# EAGLE design ll4-sensor-comm (EAGLE 5.10)
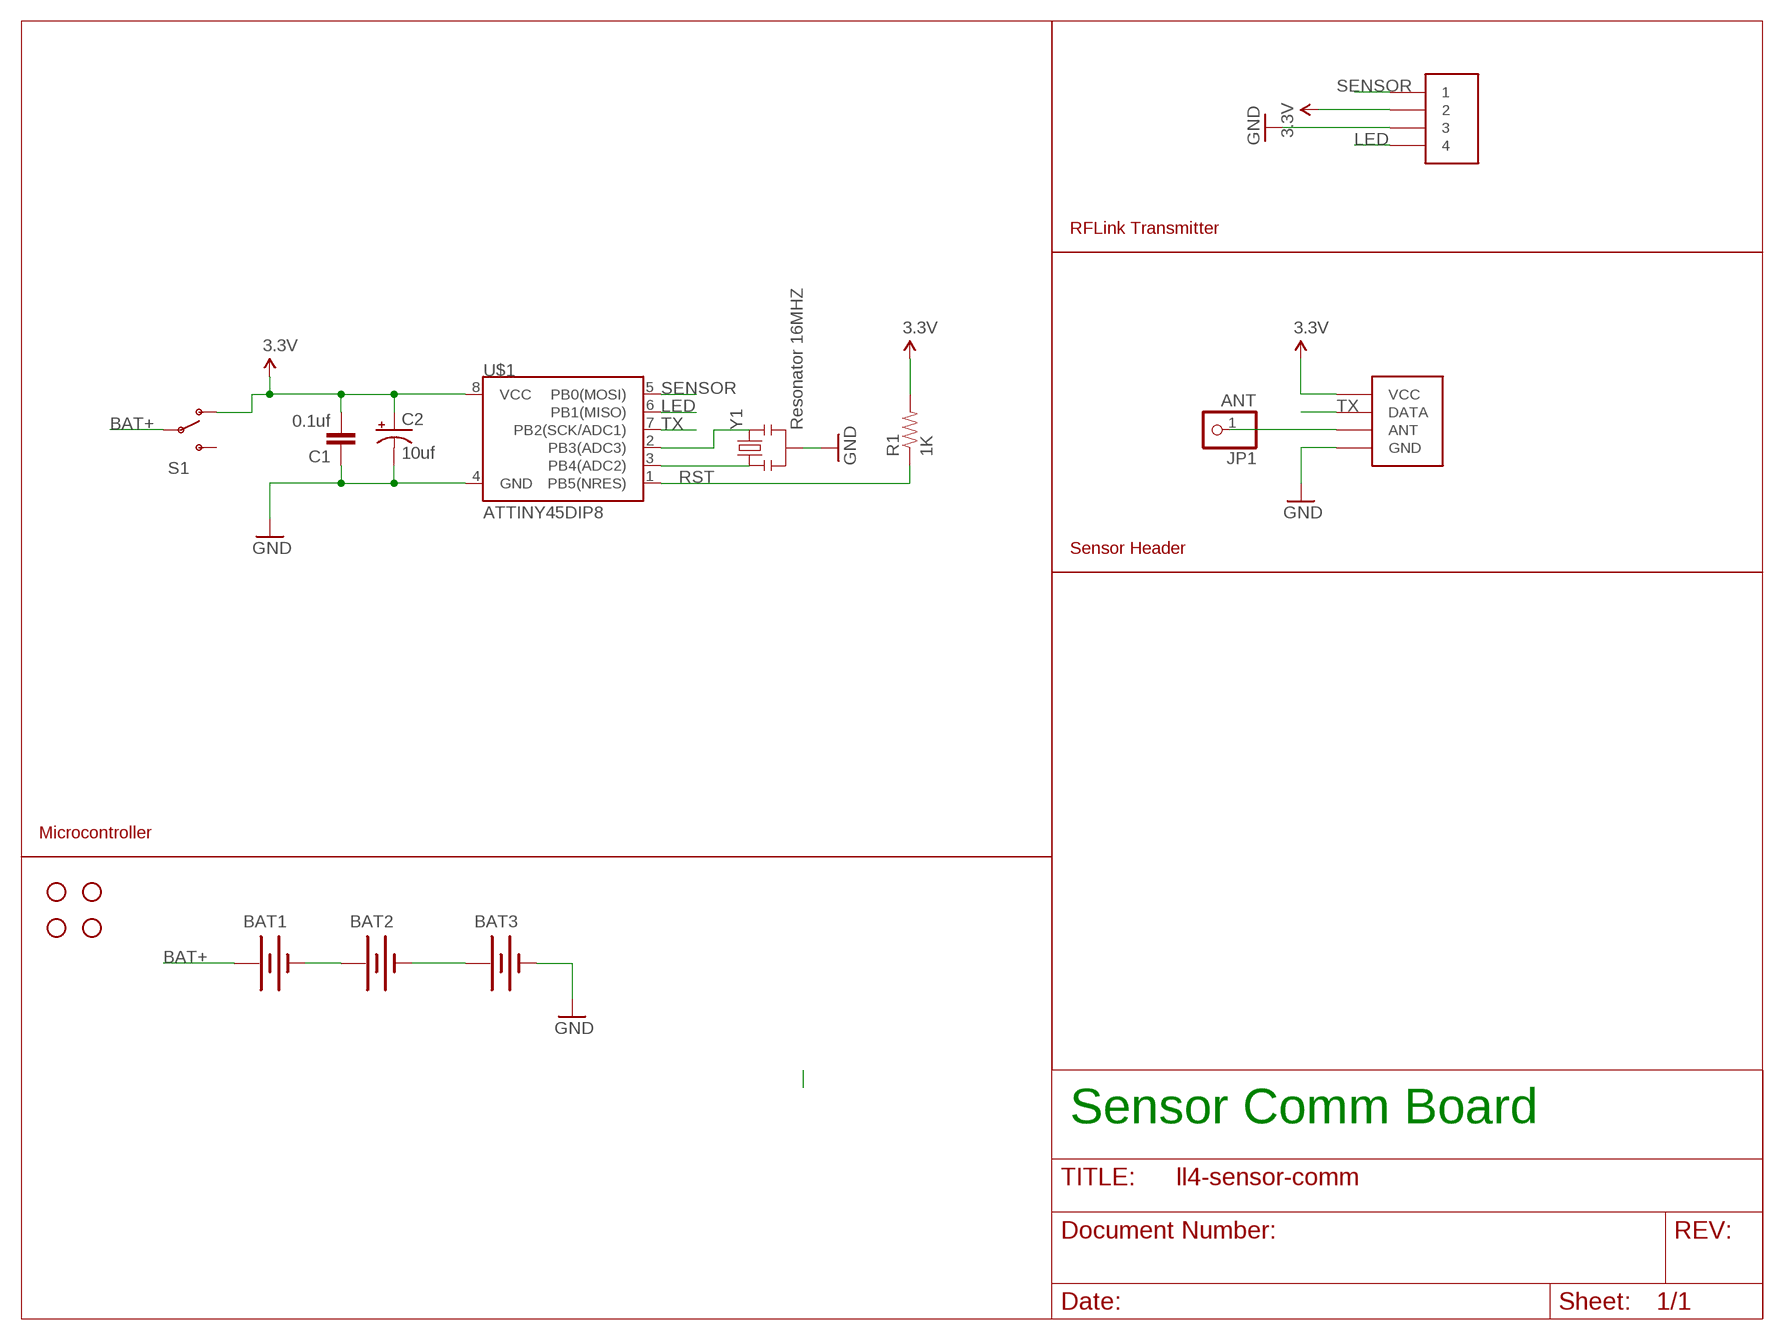
[diagram p0: schematic, sheet 1]

## Parts
BAT1  BATTERYAAA  [BATTERY-AAA]
BAT2  BATTERYAAA  [BATTERY-AAA]
BAT3  BATTERYAAA  [BATTERY-AAA]
C1  0.1uf  CAPPTH  [CAP-PTH-SMALL]
C2  10uf  CAP_POLPTH2  [CPOL-RADIAL-10UF-25V]
JP1  ANT  PINHD-1X1  [1X01]
JP2  STAND-OFF  [STAND-OFF]
JP3  STAND-OFF  [STAND-OFF]
JP4  STAND-OFF  [STAND-OFF]
JP5  STAND-OFF  [STAND-OFF]
R1  1K  RESISTORPTH-1/4W  [AXIAL-0.4]
RFLINK  RFLINK-TX  [RFLINK-TX]
S1  SWITCH-SPSTPTH  [SWITCH-SPDT]
SENSOR  4HEAD  [4HEAD]
U$1  ATTINY45DIP8  [DIP08]
Y1  Resonator 16MHZ  RESONATORPTH  [RESONATOR-PTH]

## Nets
3.3V: C1.2 C2.1(+) R1.P$2 RFLINK.3(VCC) S1.1(O) SENSOR.2 U$1.8(VCC)
BAT+: BAT1.PWR@1(+) S1.2(P)
GND: BAT3.GND@1(-) C1.1 C2.2(-) RFLINK.1(GND) SENSOR.3 U$1.4(GND) Y1.2
LED: SENSOR.4 U$1.6(PB1(MISO))
N$1: U$1.2(PB3(ADC3)) Y1.3
N$2: U$1.3(PB4(ADC2)) Y1.1
N$3: JP1.1 RFLINK.4(ANT)
N$5: BAT1.GND@1(-) BAT2.PWR@1(+)
N$7: BAT2.GND@1(-) BAT3.PWR@1(+)
RST: R1.P$1 U$1.1(PB5(NRES))
SENSOR: SENSOR.1 U$1.5(PB0(MOSI))
TX: RFLINK.2(DATA) U$1.7(PB2(SCK/ADC1))
Unconnected: S1.3(S)

## Notes on the sheet
- RFLink Transmitter
- Sensor Header
- Microcontroller
- Sensor Comm Board

## Library data of the parts
BAT1-BAT3 = sparkfun:BATTERY: Battery Holders Various common sizes : AA, AAA, 20mm coin cell and 12mm coin cell.
C1 = sparkfun:CAP: Capacitor Standard 0603 ceramic capacitor, and 0.1" leaded capacitor.
C2 = sparkfun:CAP_POL: Capacitor Polarized These are standard SMD and PTH capacitors. Normally 10uF, 47uF, and 100uF in electrolytic and tantalum varieties. Always verify the external diameter of the through hole cap, it varies with capacity, voltage, and manufacturer. The EIA devices should be standard.
JP1 = pinhead:PINHD-1X1: PIN HEADER
JP2-JP5 = sparkfun:STAND-OFF: Stand Off This is the mechanical footprint for a #4 phillips button head screw. Use the keepout ring to avoid running the screw head into surrounding components. SKU : PRT-00447
R1 = sparkfun:RESISTOR: Resistor Basic schematic elements and footprints for 0603, 1206, and PTH resistors.
RFLINK = custom:RFLINK-TX
S1 = sparkfun:SWITCH-SPST: SPST Switch Simple slide switch. Spark Fun Electronics SKU : COM-00102
SENSOR = custom:4HEAD
U$1 = sparkfun:ATTINY45: Atmel ATTiny45
Y1 = sparkfun:RESONATOR: Resonator Small SMD resonator. This is the itty bitty 10/20MHz resonators with built in caps. CSTCE10M0G55 and CSTCE20M0V53. Footprint has been reviewed closely but hasn't been tested yet.

## Board
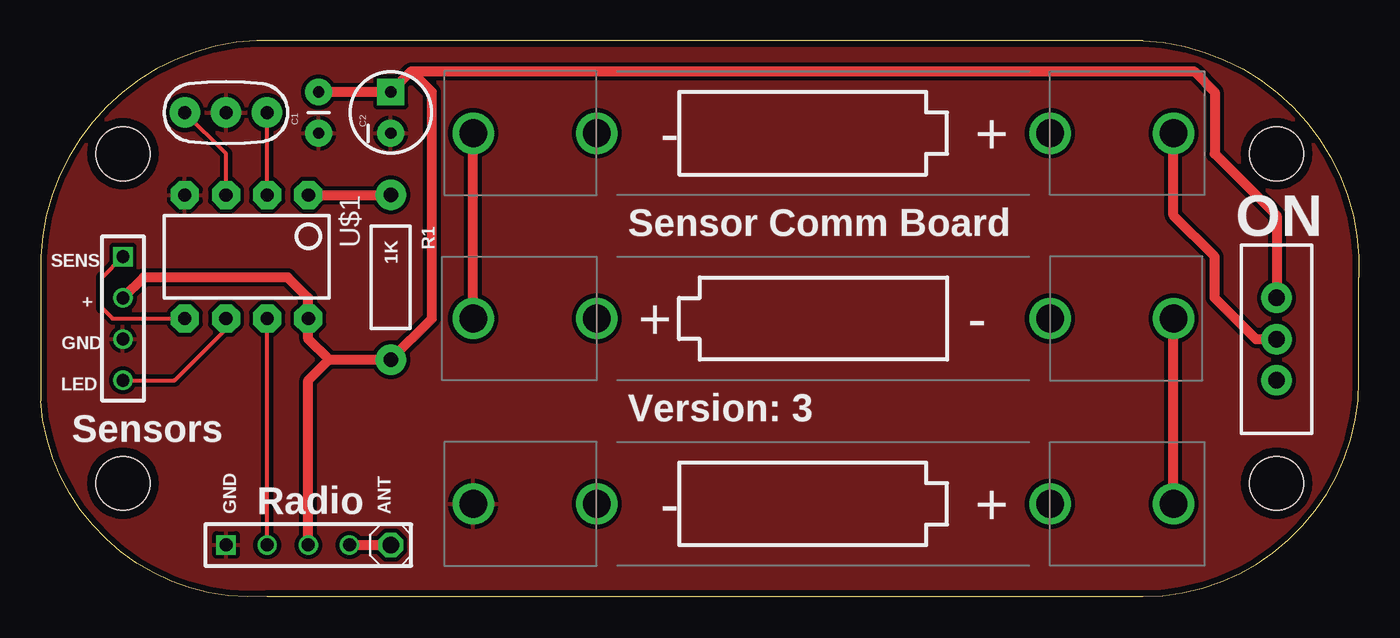
[diagram p1: board, top side]
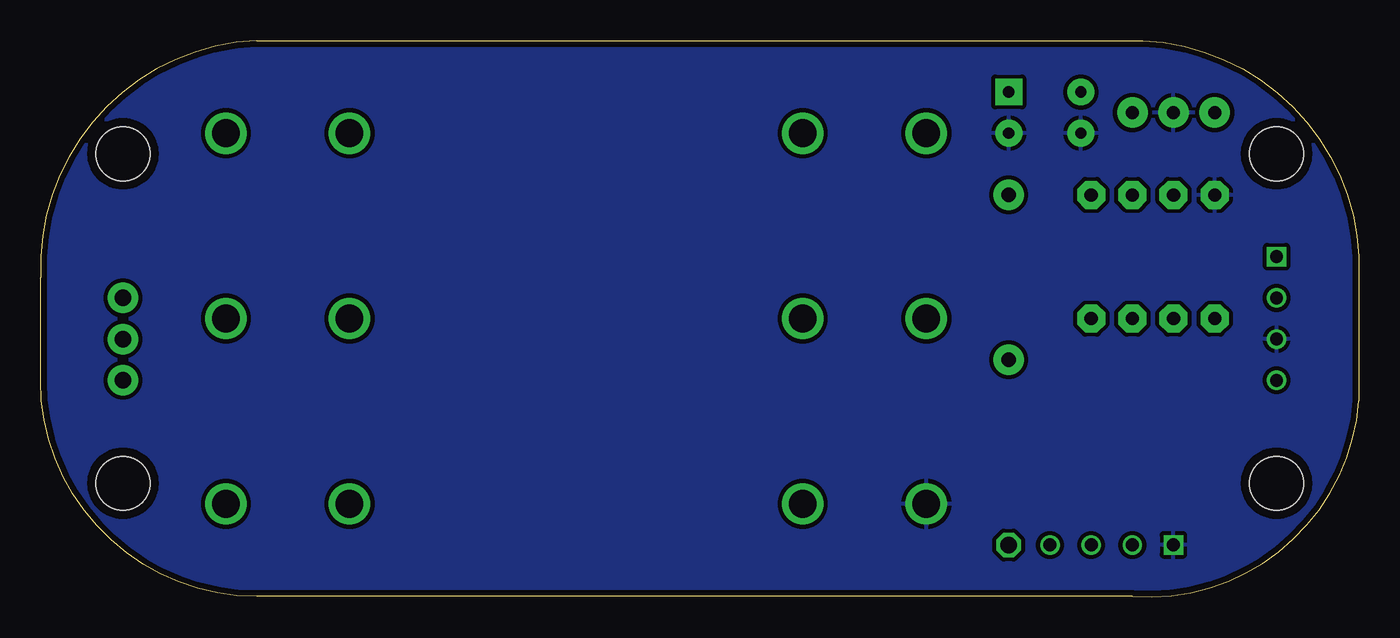
[diagram p2: board, bottom side, seen from below]

Size 81.28 x 34.32 mm. Coordinates in mm from the lower left corner, seen from the top.
Outline: 0,19.72 0,12.1 arc90 13.97,0.03 67.94,0.03 arc90 81.28,13.37 81.28,19.72 arc90 67.94,34.32 13.34,34.32 arc90 0,19.72
Copper layers (1*16): Top 0.0356mm / dielectric 1.5011mm / Bottom 0.0356mm
Design rules "LaenPCBOrder": minimum track width 6mil, minimum drill 13mil, track to track 6mil, track to pad 6mil, pad to pad 6mil, via to via 6mil, smd to smd 6mil, copper to edge 15mil, drill to drill 6mil, minimum pad ring 7mil, minimum via ring 7mil, stop-mask expansion 4mil, vias tented up to drill 0mil, thermal gap 10mil

### Footprints (pad centres in the part's own frame; a part is rotated, then mirrored left to right if it is on the bottom)
BATTERY-AAA = drill 1.702 round: GND@1 21.59,0; GND@2 13.97,0; PWR@1 -21.59,0; PWR@2 -13.97,0
CAP-PTH-SMALL = drill 0.7 pad 1.651 round: 1 0,0; 2 2.54,0
CPOL-RADIAL-10UF-25V = drill 0.7 pad 1.651 square: 1 1.27,0 | drill 0.7 pad 1.651 round: 2 -1.27,0
1X01 = drill 1.016 octagon: 1 0,0
STAND-OFF = hole 3.302: 0,0
AXIAL-0.4 = drill 0.9 pad 1.88 round: P$1 -5.08,0; P$2 5.08,0
RFLINK-TX = drill 0.8 square: 1 -3.81,0 | drill 0.8 round: 2 -1.27,0; 3 1.27,0; 4 3.81,0
SWITCH-SPDT = drill 1.016 pad 1.88 round: 1 0,2.54; 2 0,0; 3 0,-2.54
4HEAD = drill 0.8 square: 1 -3.81,0 | drill 0.8 round: 2 -1.27,0; 3 1.27,0; 4 3.81,0
DIP08 = drill 0.813 pad 1.727 octagon: 1 -3.81,-3.81; 2 -1.27,-3.81; 3 1.27,-3.81; 4 3.81,-3.81; 5 3.81,3.81; 6 1.27,3.81; 7 -1.27,3.81; 8 -3.81,3.81
RESONATOR-PTH = drill 0.8 pad 1.88 round: 1 -2.54,0; 2 0,0; 3 2.54,0

### Placement (x,y rotation side)
BAT1  48.26,28.61 180 top
BAT2  48.26,17.18 0 top
BAT3  48.26,5.75 180 top
C1  17.14,28.61 90 top
C2  21.59,29.88 90 top
JP1  21.59,3.21 0 top
JP2  76.2,27.34 0 top
JP3  76.2,7.02 0 top
JP4  5.08,27.34 0 top
JP5  5.08,7.02 0 top
R1  21.59,19.72 270 top
RFLINK  15.24,3.21 180 bottom
S1  76.2,15.91 0 top
SENSOR  5.08,17.18 270 top
U$1  12.7,20.99 180 top
Y1  11.43,29.88 0 top

### Tracks (layer width: path | path; a pad name or v marks a point on that pad's centre or on a via)
3.3V
  Top 0.61: S1.1 76.2,23.53 72.39,27.34 72.39,31.15 71.12,32.42 22.86,32.42 | 22.86,32.42 C2.1 C1.2 | 22.86,32.42 24.13,31.15 24.13,17.18 R1.P$2 17.78,14.64 | 17.78,14.64 16.51,15.91 U$1.8 16.51,18.45 15.24,19.72 6.35,19.72 SENSOR.2 | RFLINK.3 16.51,13.37 17.78,14.64
BAT+
  Top 0.61: S1.2 74.93,15.91 72.39,18.45 72.39,20.99 69.85,23.53 BAT1.PWR@1
GND
  pour Bottom (isolate 0.254): 0,34.32 81.92,34.32 80.64,0.03 0,0.03
  pour Top (isolate 0.254): 0,34.32 81.92,34.32 80.64,0.03 0,0.03
LED
  Top 0.254: U$1.6 11.43,16.54 8.26,13.37 SENSOR.4
N$1
  Top 0.254: U$1.2 Y1.3
N$2
  Top 0.254: U$1.3 11.43,27.34 Y1.1
N$3
  Top 0.61: RFLINK.4 JP1.1
N$5
  Top 0.61: BAT2.PWR@1 BAT1.GND@1
N$7
  Top 0.61: BAT3.PWR@1 BAT2.GND@1
RST
  Top 0.61: U$1.1 R1.P$1
SENSOR
  Top 0.254: U$1.5 4.45,17.18 3.81,17.81 3.81,19.72 SENSOR.1
TX
  Top 0.254: RFLINK.2 U$1.7

### Text on the board
tPlace: Sensor Comm Board | ON | SENS | + | GND | LED | Version: 3 | Sensors | GND | Radio | ANT